# Altium schematic sheet data_interface.SchDoc
size A4; SheetNumber: 5; SheetTotal: 6
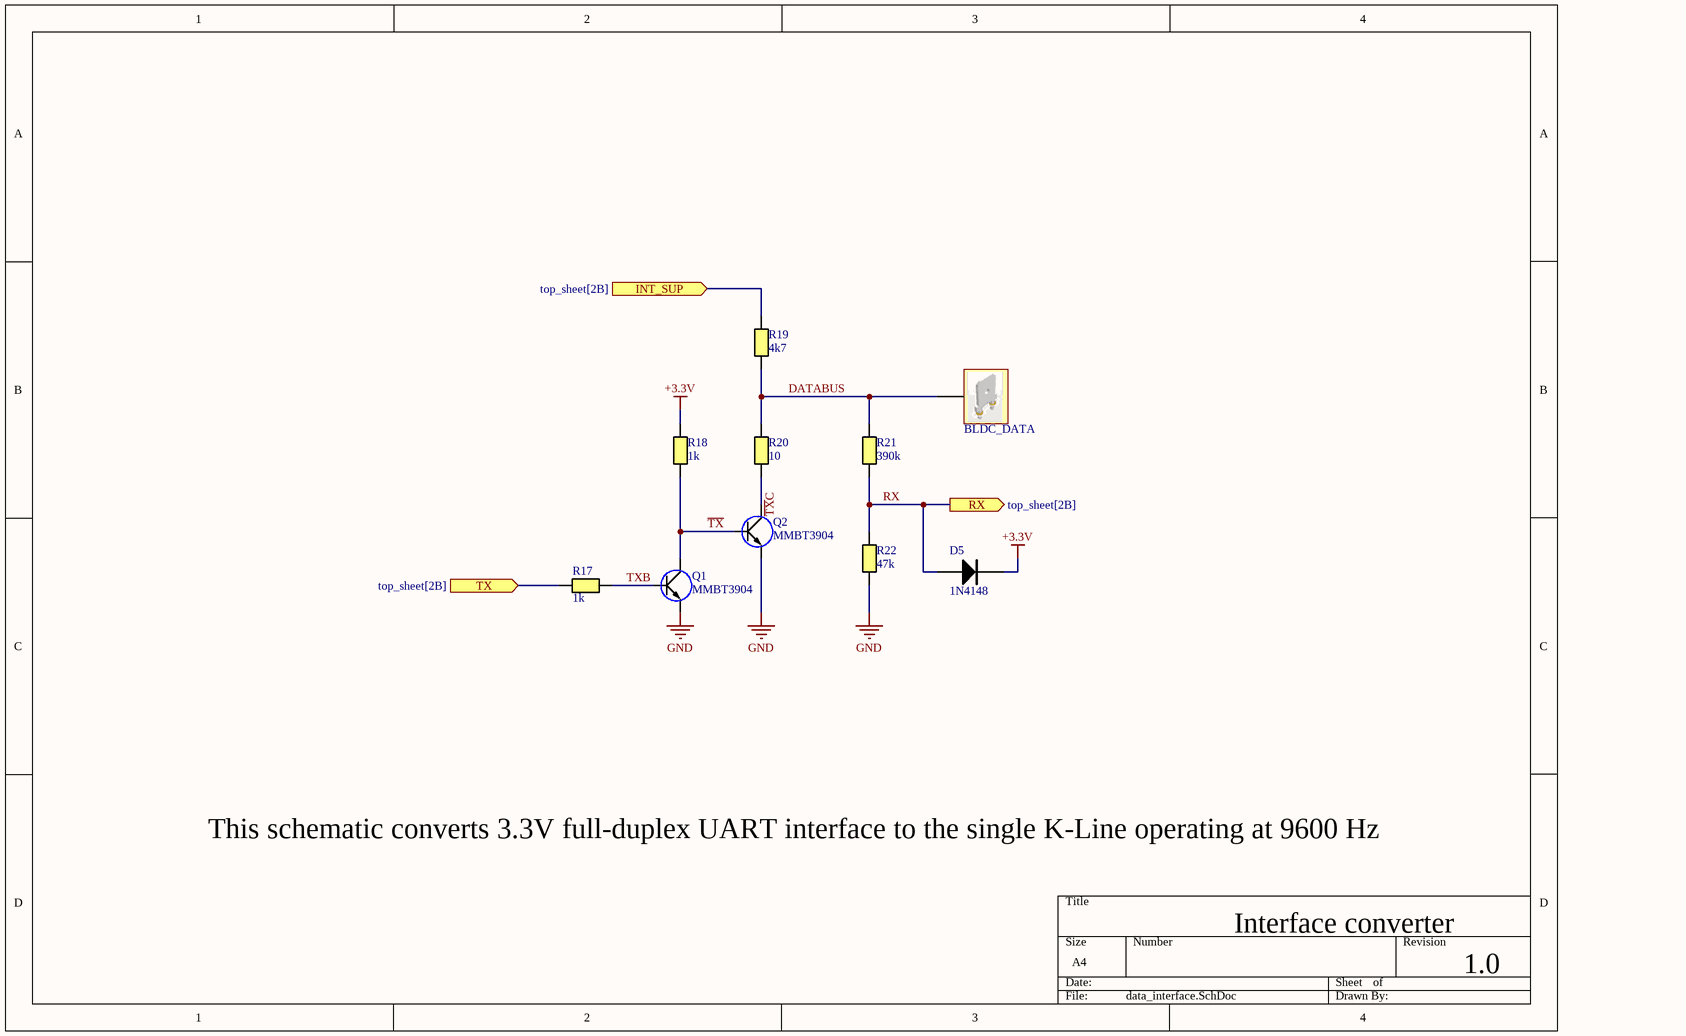
[diagram p0: data_interface.SchDoc]

## Parts
BLDC_DATA  Crimp 6.3 single PCB  [Crimp 6.3mm single PCB]  (value not drawn)
D5  1N4148  [SOD80]
Q1  MMBT3904  [SOT23]
Q2  MMBT3904  [SOT23]
R17  1k  [RESC0603(1608)_N]
R18  1k  [RESC0603(1608)_N]
R19  4k7  [RESC0603(1608)_N]
R20  10  [RESC0603(1608)_N]
R21  390k  [RESC0603(1608)_N]
R22  47k  [RESC0603(1608)_N]

## Ports
INT_SUP (in, see top_sheet[2B]), RX (out, see top_sheet[2B]), TX (in, see top_sheet[2B])

## Nets
+3.3V: D5.2(K) R18.2
GND: Q1.2(E) Q2.2(E) R22.1
DATABUS: BLDC_DATA.1 R19.1 R20.2 R21.2
INT_SUP: R19.2 ; port INT_SUP
RX: D5.1(A) R21.1 R22.2 ; port RX
~{TX}: Q1.3(C) Q2.1(B) R18.1
~{TX}C: Q2.3(C) R20.1
TX: R17.1 ; port TX
TXB: Q1.1(B) R17.2

## Notes on the sheet
- This schematic converts 3.3V full-duplex UART interface to the single K-Line operating at 9600 Hz
- Interface converter
- 1.0

## Library data of the parts
BLDC_DATA = Crimp 6.3 single PCB: Straight Mount Angle PCB Tab Terminal
D5 = 1N4148: Small Signal Fast Switching Diodes; Repetitive peak reverse voltage: 100 V; Reverse voltage: 75 V; Peak forward surge current: 2 A; Repetitive peak forward current: 500 mA; Forward continuous current: 300 mA; Average forward current: 150 mA; Diode capacitance: 4 pF; Reverse recovery time: 4 ~ 8 ns; Supplier 1: Mouser; Supplier Part Number 1: 78-MCL4148
Q1 Q2 = 2N3904: NPN General Purpose Transistor; Collector-Emitter Voltage: 40V; Collector-Base Voltage: 60V; Collector Current - Continuous: 200mA; DC Current Gain: 300
R17-R22 = Resistor M: Resistor Medium Density
  R17 R18: Value: 1k
  R19: Value: 4k7
  R20: Value: 10
  R21: Value: 390k
  R22: Value: 47k